# Altium project cp2102_usbC.PrjPCB
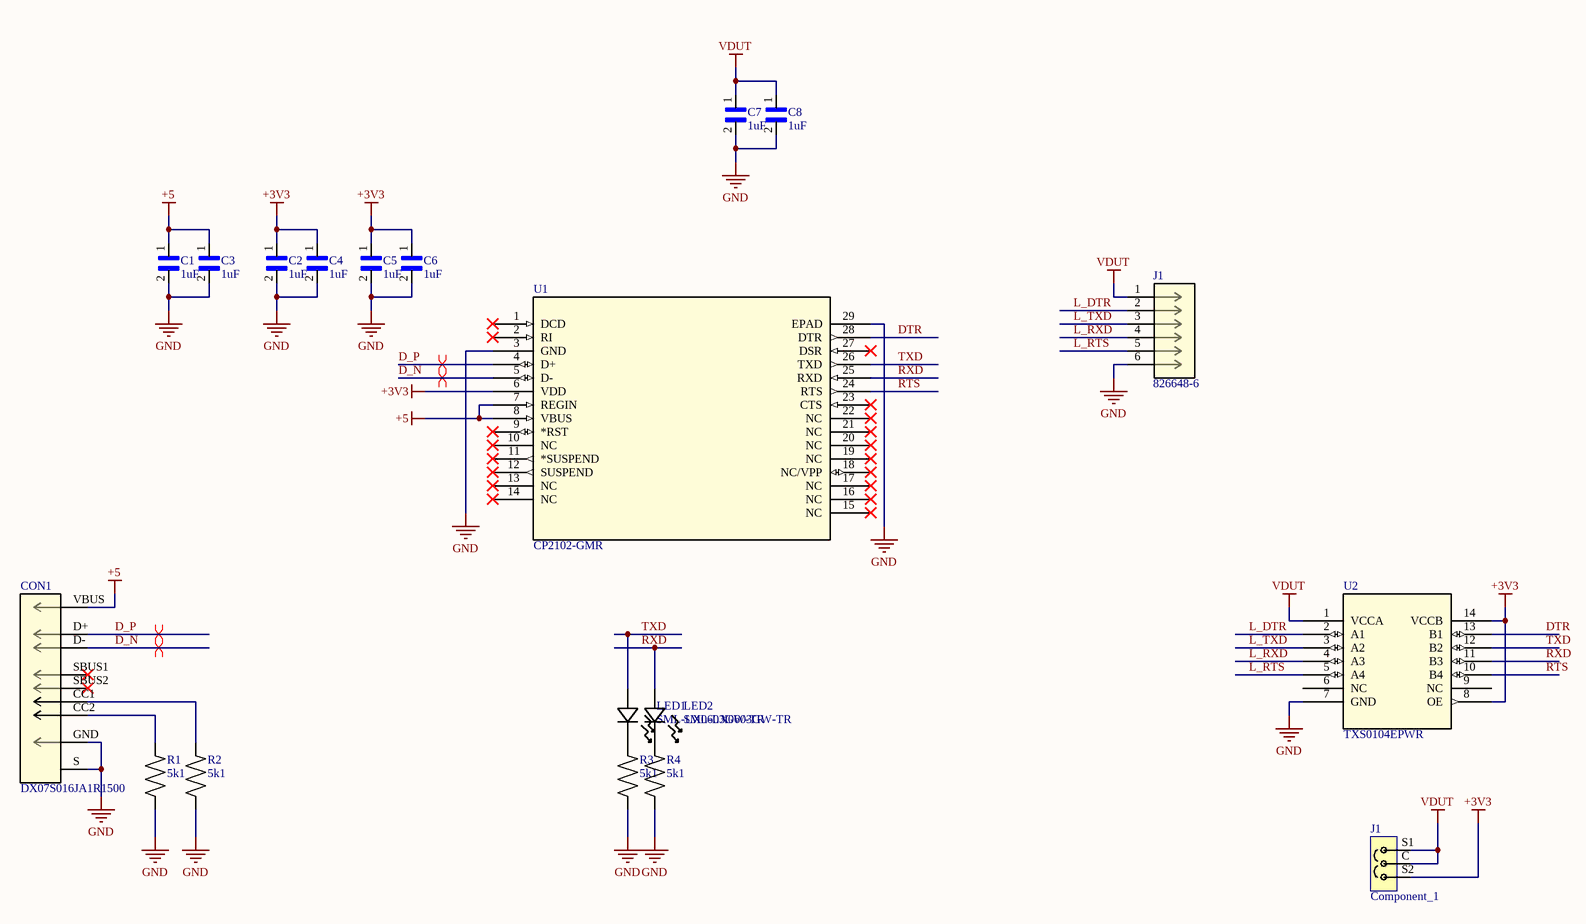
[diagram p0: cp2102_usbC.SchDoc]
1 sheet, 19 parts. Net scope: global (net labels, ports and power ports of the same name join across sheets).
Board file: cp2102_usbC.PcbDoc

## Sheet cp2102_usbC.SchDoc
size A3

### Parts
(Parts that share a designator on the sheet are numbered #1, #2 ... from top to bottom, then left to right.)
C1  1uF  [*CAPC1608X90N]
C2  1uF  [*CAPC1608X90N]
C3  1uF  [*CAPC1608X90N]
C4  1uF  [*CAPC1608X90N]
C5  1uF  [*CAPC1608X90N]
C6  1uF  [*CAPC1608X90N]
C7  1uF  [*CAPC1608X90N]
C8  1uF  [*CAPC1608X90N]
CON1  DX07S016JA1R1500  [CONN12_016JA1R1500_JAE]
J1#1  826648-6  [CONN6_826648-6_TEC]
J1#2  Component_1  [jump_1t2p]
LED1  SML-LX0603GW-TR  [LED_SML-LX0603GW-TR_LUM]
LED2  SML-LX0603GW-TR  [LED_SML-LX0603GW-TR_LUM]
R1  5k1  [*RESC1608X55N]
R2  5k1  [*RESC1608X55N]
R3  5k1  [*RESC1608X55N]
R4  5k1  [*RESC1608X55N]
U1  CP2102-GMR  [QFN28_5X5_SIL]
U2  TXS0104EPWR  [PW14]

### Nets
+3V3: C2.1 C4.1 C5.1 C6.1 J1#2.S2 U1.6(VDD) U2.8(OE) U2.14(VCCB)
+5: C1.1 C3.1 CON1.VBUS U1.7(REGIN) U1.8(VBUS)
GND: C1.2 C2.2 C3.2 C4.2 C5.2 C6.2 C7.2 C8.2 CON1.GND CON1.S(SA) J1#1.6 R1.1 R2.1 R3.1 R4.1 U1.3(GND) U1.29(EPAD) U2.7(GND)
VDUT: C7.1 C8.1 J1#1.1 J1#2.C J1#2.S1 U2.1(VCCA)
D_N: CON1.D-(D_) U1.5(D-)
D_P: CON1.D+ U1.4(D+)
DTR: U1.28(DTR) U2.13(B1)
L_DTR: J1#1.2 U2.2(A1)
L_RTS: J1#1.5 U2.5(A4)
L_RXD: J1#1.4 U2.4(A3)
L_TXD: J1#1.3 U2.3(A2)
RTS: U1.24(RTS) U2.10(B4)
RXD: LED2.2 U1.25(RXD) U2.11(B3)
TXD: LED1.2 U1.26(TXD) U2.12(B2)
NetCON1_CC1: CON1.CC1 R2.2
NetCON1_CC2: CON1.CC2 R1.2
NetLED1_1: LED1.1 R3.2
NetLED2_1: LED2.1 R4.2

Not connected (* = marked no-connect by the designer): CON1 SBUS1* SBUS2*; U1 1(DCD)* 2(RI)* 9(*RST)* 10(NC)* 11(*SUSPEND)* 12(SUSPEND)* 13(NC)* 14(NC)* 15(NC)* 16(NC)* 17(NC)* 18(NC/VPP)* 19(NC)* 20(NC)* 21(NC)* 22(NC)* 23(CTS)* 27(DSR)*; U2 6(NC) 9(NC)

### Layout directives
differential pair; differential pair class USB_D: D_N, D_P

### Library data of the parts
C1-C8 = 06033C103KAT2A: 0603 10 nF 25 V 10% Tolerance X7R Surface Mount Multilayer Ceramic Capacitor; MF: AVX; Package: 1608 AVX; MP: 06033C103KAT2A; Price: None; Availability: Unavailable; SnapEDA_Link: https://www.snapeda.com/parts/06033C103KAT2A/AVX%20/%20Kyocera/view-part/?ref=snap; Value: *
CON1 = DX07S016JA1R1500: No Description Available; Built_By: EMA_Matt; Vendor: JAE Electronics; SourceLibrary: JAE_Electronics_2020-03-30; Datasheet: https://www.digikey.com/product-detail/en/DX07S016JA1R1500/670-DX07S016JA1R1500CT-ND/11586676?utm_campaign=buynow&WT.z_cid=ref_octopart_dkc_buynow&utm_medium=aggregator&curr=usd&site=us&utm_source=octopart; Manufacturer_Part_Number: DX07S016JA1R1500; Copyright: Copyright (C) 2018 Accelerated Designs. All rights reserved; RefDes: RefDes; Type: DEV
J1#1 = 826648-6: 6P AMPMODU II STIFT LEI; Built_By: EMA_Justin; Vendor: TE Connectivity; ROWS/CONFIG: 1; PITCH(MM): 2.54; POSITIONS: 6; SourceLibrary: TE_Connectivity_250_Part_Delivery_4_2018-09-04; Copyright: Copyright (C) 2016 Accelerated Designs. All rights reserved; Manufacturer_Part_Number: 826648-6; TE_Part_Number: 826648-6; PRODUCT: Connector; Type: DEV; Datasheet: https://www.te.com/commerce/DocumentDelivery/DDEController?Action=showdoc&DocId=Customer+Drawing%7F826629%7FAC%7Fpdf%7FEnglish%7FENG_CD_826629_AC.pdf%7F826648-6; RefDes: RefDes
LED1 LED2 = SML-LX0603GW-TR: No Description Available; Vendor: Lumex; Built_By: EMA_Cory; SourceLibrary: Lumex_2020-09-08; Type: DEV; Datasheet: https://www.lumex.com/spec/SML-LX0603GW-TR.pdf; Manufacturer_Part_Number: SML-LX0603GW-TR; Copyright: Copyright (C) 2018 Accelerated Designs. All rights reserved; RefDes: RefDes
R1-R4 = CR0603-FX-4701ELF: Res Thick Film 0603 4.7K Ohm 1% 1/10W 100ppm/C Molded SMD SMD Paper Tape on Plastic Reel; MF: Bourns; MP: CR0603-FX-4701ELF; Package: 1608 Rohm Semiconductor; Price: None; SnapEDA_Link: https://www.snapeda.com/parts/CR0603-FX-4701ELF/Bourns/view-part/?ref=snap; Availability: Unavailable; Value: *
U1 = CP2102-GMR: No Description Available; Vendor: Silicon Labs; Built_By: EMA_UL_Team; SourceLibrary: Silicon_Labs_2018-12-15; Manufacturer_Part_Number: CP2102-GMR; Copyright: Copyright (C) 2018 Accelerated Designs. All rights reserved; RefDes: RefDes; Type: DEV
U2 = TXS0104EPWR: No Description Available; Mfr_Name: Texas Instruments; Copyright: Copyright (C) 2021 Ultra Librarian. All rights reserved.; Manufacturer_Part_Number: TXS0104EPWR; RefDes: RefDes; Type: DEV